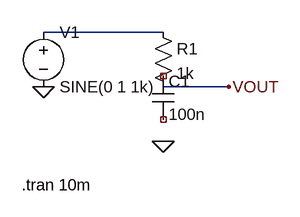
[diagram p0: schematic rc_sinus_temporel.asc]
rc_sinus_temporel.asc, the LTspice schematic file:
Version 4
SHEET 1 880 680
WIRE 80 96 256 96
WIRE 256 176 352 176
FLAG 80 176 0
FLAG 256 256 0
FLAG 352 176 VOUT
SYMBOL voltage 80 80 R0
WINDOW 123 0 0 Left 0
WINDOW 39 0 0 Left 0
SYMATTR InstName V1
SYMATTR Value SINE(0 1 1k)
SYMBOL res 240 80 R0
SYMATTR InstName R1
SYMATTR Value 1k
SYMBOL cap 240 160 R0
SYMATTR InstName C1
SYMATTR Value 100n
TEXT 48 320 Left 2 !.tran 10m

The netlist it stands for:
* rc_sinus_temporel.asc
V1 N001 0 SINE(0 1 1k)
R1 N001 VOUT 1k
C1 NC_01 NC_02 100n
.tran 10m
.backanno
.end